# Altium project 检测板.PrjPCB
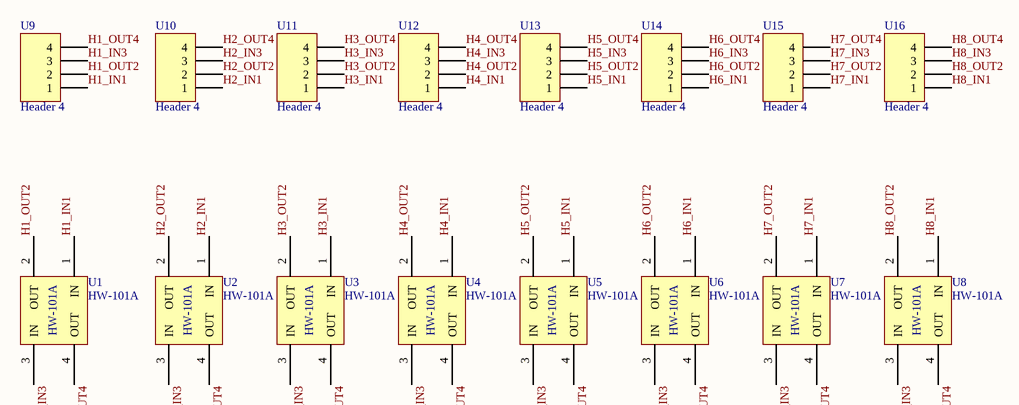
[diagram p0: 检测板.SchDoc]
1 sheet, 16 parts. Net scope: global (net labels, ports and power ports of the same name join across sheets).
Board file: 检测板.PcbDoc

## Sheet 检测板.SchDoc
size A4

### Parts
U1  HW-101A  [SOT-23-4]
U2  HW-101A  [SOT-23-4]
U3  HW-101A  [SOT-23-4]
U4  HW-101A  [SOT-23-4]
U5  HW-101A  [SOT-23-4]
U6  HW-101A  [SOT-23-4]
U7  HW-101A  [SOT-23-4]
U8  HW-101A  [SOT-23-4]
U9  Header 4  [PIN4]
U10  Header 4  [PIN4]
U11  Header 4  [PIN4]
U12  Header 4  [PIN4]
U13  Header 4  [PIN4]
U14  Header 4  [PIN4]
U15  Header 4  [PIN4]
U16  Header 4  [PIN4]

### Nets
H1_IN1: U1.1(IN) U9.1
H1_IN3: U1.3(IN) U9.3
H1_OUT2: U1.2(OUT) U9.2
H1_OUT4: U1.4(OUT) U9.4
H2_IN1: U2.1(IN) U10.1
H2_IN3: U2.3(IN) U10.3
H2_OUT2: U2.2(OUT) U10.2
H2_OUT4: U2.4(OUT) U10.4
H3_IN1: U3.1(IN) U11.1
H3_IN3: U3.3(IN) U11.3
H3_OUT2: U3.2(OUT) U11.2
H3_OUT4: U3.4(OUT) U11.4
H4_IN1: U4.1(IN) U12.1
H4_IN3: U4.3(IN) U12.3
H4_OUT2: U4.2(OUT) U12.2
H4_OUT4: U4.4(OUT) U12.4
H5_IN1: U5.1(IN) U13.1
H5_IN3: U5.3(IN) U13.3
H5_OUT2: U5.2(OUT) U13.2
H5_OUT4: U5.4(OUT) U13.4
H6_IN1: U6.1(IN) U14.1
H6_IN3: U6.3(IN) U14.3
H6_OUT2: U6.2(OUT) U14.2
H6_OUT4: U6.4(OUT) U14.4
H7_IN1: U7.1(IN) U15.1
H7_IN3: U7.3(IN) U15.3
H7_OUT2: U7.2(OUT) U15.2
H7_OUT4: U7.4(OUT) U15.4
H8_IN1: U8.1(IN) U16.1
H8_IN3: U8.3(IN) U16.3
H8_OUT2: U8.2(OUT) U16.2
H8_OUT4: U8.4(OUT) U16.4

### Library data of the parts
U9-U16 = Header 4: Header, 4-Pin; LatestRevisionDate: 17-Jul-2002; LatestRevisionNote: Re-released for DXP Platform.; Publisher: Altium Limited